# EAGLE schematic schematic (EAGLE 9.6.0)
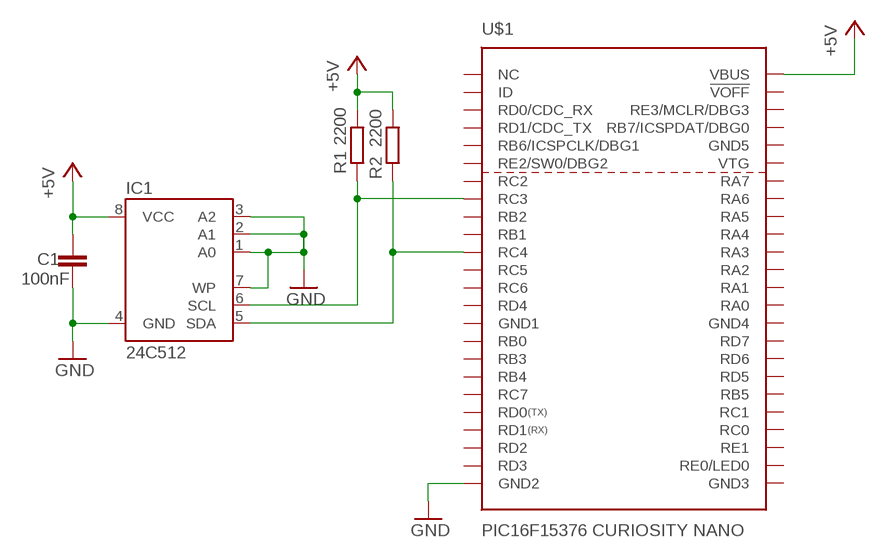
[diagram p0: schematic, sheet 1]

## Parts
C1  100nF  C-EU025-024X044  [C025-024X044]
IC1  24C512  AT24CP  [DIL08]
R1  2200  R-EU_0204/7  [0204/7]
R2  2200  R-EU_0204/7  [0204/7]
U$1  PIC16F15376_CURIOSITY_NANO  [48PIN_CURIOSITY_NANO]

## Nets
+5V: C1.1 IC1.8(VCC) R1.2 R2.2 U$1.P$48(VBUS)
GND: C1.2 IC1.1(A0) IC1.2(A1) IC1.3(A2) IC1.4(GND) IC1.7(WP) U$1.P$24(GND2)
N$1: IC1.6(SCL) R1.1 U$1.P$8(RC3)
N$2: IC1.5(SDA) R2.1 U$1.P$11(RC4)
Unconnected: U$1.P$1(NC) U$1.P$2(ID) U$1.P$3(RD0/CDC_RX) U$1.P$4(RD1/CDC_TX) U$1.P$5(RB6/ICSPCLK/DBG1) U$1.P$6(RE2/SW0/DBG2) U$1.P$7(RC2) U$1.P$9(RB2) U$1.P$10(RB1) U$1.P$12(RC5) U$1.P$13(RC6) U$1.P$14(RD4) U$1.P$16(RB0) U$1.P$17(RB3) U$1.P$18(RB4) U$1.P$19(RC7) U$1.P$20(RD0) U$1.P$21(RD1) U$1.P$22(RD2) U$1.P$23(RD3) U$1.P$26(RE0/LED0) U$1.P$27(RE1) U$1.P$28(RC0) U$1.P$29(RC1) U$1.P$30(RB5) U$1.P$31(RD5) U$1.P$32(RD6) U$1.P$33(RD7) U$1.P$35(RA0) U$1.P$36(RA1) U$1.P$37(RA2) U$1.P$38(RA3) U$1.P$39(RA4) U$1.P$40(RA5) U$1.P$41(RA6) U$1.P$42(RA7) U$1.P$45(RB7/ICSPDAT/DBG0) U$1.P$46(RE3/MCLR/DBG3)

## Power pins joined to a net without a drawn wire
!VOFF: U$1.P$47(!VOFF)
GND1: U$1.P$15(GND1)
GND3: U$1.P$25(GND3)
GND4: U$1.P$34(GND4)
GND5: U$1.P$44(GND5)
VTG: U$1.P$43(VTG)

## Library data of the parts
C1 = rcl:C-EU: CAPACITOR, European symbol; SPICEPREFIX: C
IC1 = atmel:AT24C*: 2-wire serial EEPROM; MPN: AT24C1024BW-SH-B; OC_FARNELL: 1362646; OC_NEWARK: 03P2044
R1 R2 = rcl:R-EU_: RESISTOR, European symbol; SPICEPREFIX: R
U$1 = Microchip_Curiosity_Nano:PIC16F15376_CURIOSITY_NANO: Microchip PIC16F15376 Curiosity Nano Development Platform for PIC16F15376 MCU Created by Giovanni Bernardo www.settorezero.com Description PIC16F15376 Curiosity Nano Evaluation Kit. Part NO. DM164148 Link to Microchip webpage about PIC16F15376 Curiosity Nano <https://www.microchip.com/DevelopmentTools/ProductDetails/PartNO/DM164148>